# Altium project EE311_Example_Boost.PrjPcb
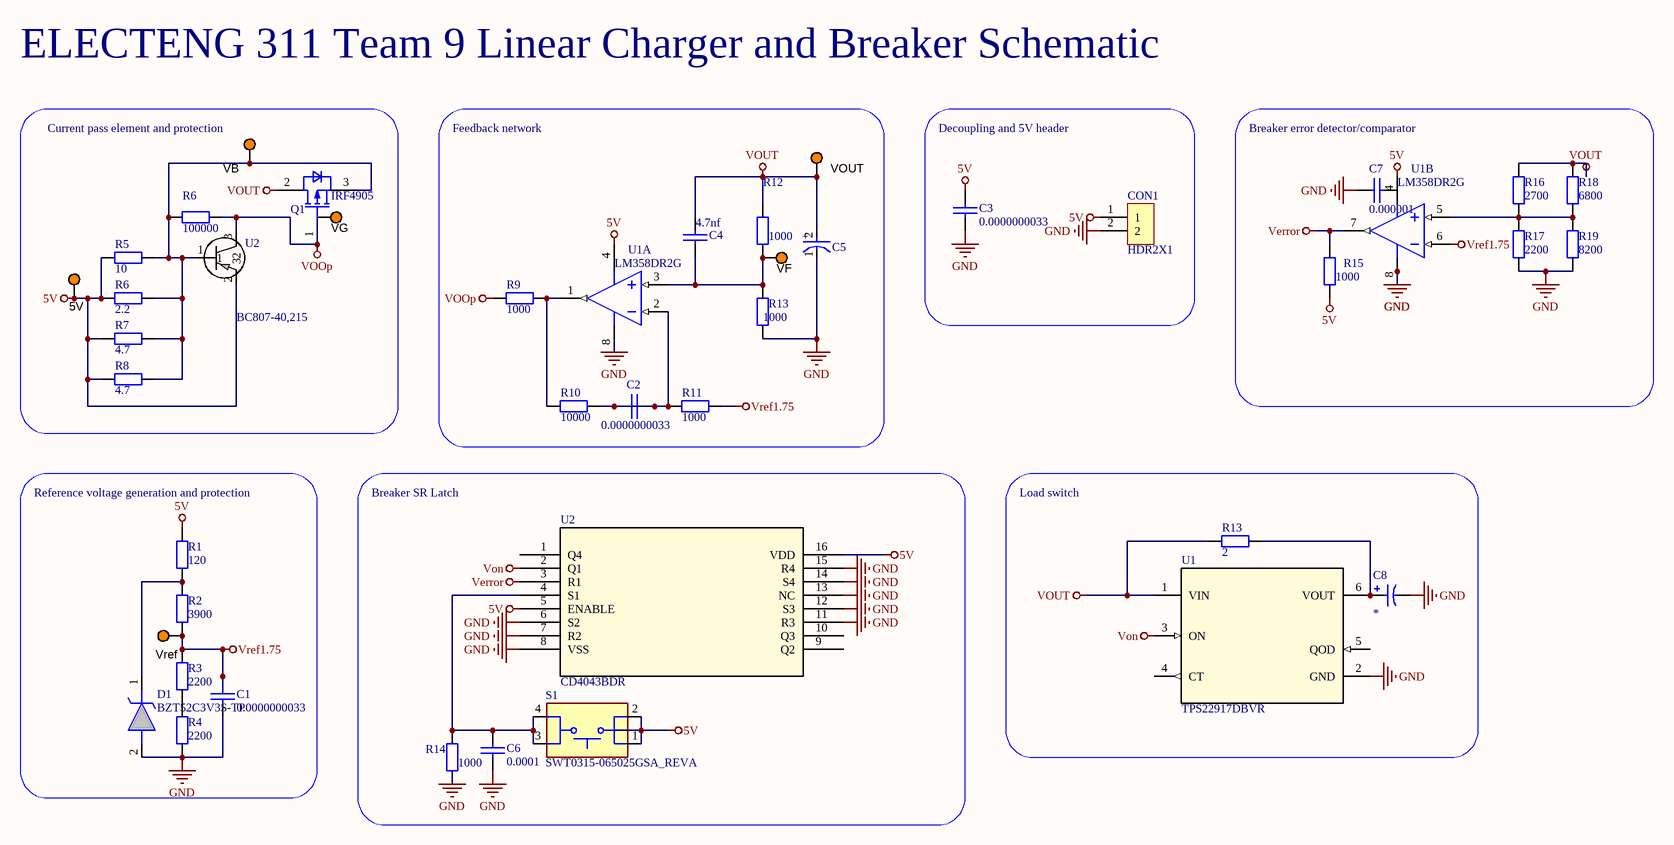
[diagram p0: EE311_Example_Boost_Sch.SchDoc]
1 sheet, 43 parts. Net scope: global (net labels, ports and power ports of the same name join across sheets).
Board file: EE311_Example_Boost_PCB.PcbDoc

## Sheet EE311_Example_Boost_Sch.SchDoc: ELECTENG 311 - Boost Converter
size A3; Author: Duleepa J Thrimawithana; Organization: Power Electronics Group; Address1: The University of Auckland; Address2: 20 Symonds Street; Address3: Auckland 1010; Address4: New Zealand; Revision: 1R1; SheetNumber: 1; SheetTotal: 1

### Parts
(Parts that share a designator on the sheet are numbered #1, #2 ... from top to bottom, then left to right.)
5V  5003  [TP_TH]  (value not drawn)
C1  0.0000000033  [0805 CAP]
C2  0.0000000033  [0805 CAP]
C3  0.0000000033  [0805 CAP]
C4  4.7nf  [0805 CAP]
C5  EEE-FK1K330P  [FP-FKF-MFG]  (value not drawn)
C6  0.0001  [0805 CAP]
C7  0.000001  [0805 CAP]
C8  *  [CAP-RAD-2.5mm Pitch]
CON1  HDR2X1  [HDR2X1_2P54]
D1  BZT52C3V3S-TP  [SOD2512X115N]
Q1  IRF4905  [IFX-PG-TO220-3-904-1]
R1  120  [0805 RES]
R2  3900  [0805 RES]
R3  2200  [0805 RES]
R4  2200  [0805 RES]
R5  10  [0805 RES]
R6#1  100000  [0805 RES]
R6#2  2.2  [0805 RES]
R7  4.7  [0805 RES]
R8  4.7  [0805 RES]
R9  1000  [0805 RES]
R10  10000  [0805 RES]
R11  1000  [0805 RES]
R12  1000  [0805 RES]
R13#1  1000  [0805 RES]
R13#2  2  [0805 RES]
R14  1000  [0805 RES]
R15  1000  [0805 RES]
R16  2700  [0805 RES]
R17  2200  [0805 RES]
R18  6800  [0805 RES]
R19  8200  [0805 RES]
S1  SWT0315-065025GSA_REVA  [SW_SWT0315-065025GSA_REVA]
U1#1  LM358DR2G  [ONSC-SOIC-8-751-07_V]  (parts A,B of 2)
U1#2  TPS22917DBVR  [DBV0006_N]
U2#1  BC807-40,215  [SOT23_NEX]
U2#2  CD4043BDR  [D16]
VB  5003  [TP_TH]  (value not drawn)
VF  5003  [TP_TH]  (value not drawn)
VG  5003  [TP_TH]  (value not drawn)
VOUT  5003  [TP_TH]  (value not drawn)
Vref  5003  [TP_TH]  (value not drawn)

### Blocks framed on the sheet
Current pass element and protection: 5V Q1 R5 R6#1 R6#2 R7 R8 U2#1 VB VG
Feedback network: C2 C4 C5 R9-R12 R13#1 U1#1 VF VOUT
Decoupling and 5V header: C3 CON1
Breaker error detector/comparator: C7 R15-R19 U1#1
Reference voltage generation and protection: C1 D1 R1-R4 Vref
Breaker SR Latch: C6 R14 S1 U2#2
Load switch: C8 R13#2 U1#2

### Nets
5V: 5V.1 C3.2 CON1.1 R1.2 R5.1 R6#2.1 R7.1 R8.1 R15.1 S1.1 S1.2 U1#1.4(VEE/GND) U2#1.2(3) U2#2.5(ENABLE) U2#2.16(VDD)
GND: C1.1 C3.1 C5.1(C) C6.2 C7.1 C8.2 CON1.2 D1.2(A) R4.2 R13#1.1 R14.1 R17.1 R19.2 U1#1.8(VCC) U1#2.2(GND) U2#2.6(S2) U2#2.7(R2) U2#2.8(VSS) U2#2.11(R3) U2#2.12(S3) U2#2.13(NC) U2#2.14(S4) U2#2.15(R4)
Verror: R15.2 U1#1.7(OUTB) U2#2.3(R1)
Von: U1#2.3(ON) U2#2.2(Q1)
VOOp: Q1.1(GATE) R6#1.2 R9.1 U2#1.3(2) VG.1
VOUT: C4.1 C5.2(A) Q1.2(DRAIN) R12.2 R13#2.1 R16.1 R18.1 U1#2.1(VIN) VOUT.1
Vref1.75: C1.2 R2.2 R3.1 R11.2 U1#1.6(INB-) Vref.1
NetC2_1: C2.1 C2.2 R10.1 R11.1 U1#1.2(INA-)
NetC4_2: C4.2 R12.1 R13#1.2 U1#1.3(INA+) VF.1
NetC6_1: C6.1 R14.2 S1.3 S1.4 U2#2.4(S1)
NetC8_1: C8.1 R13#2.2 U1#2.6(VOUT)
NetD1_1: D1.1(K) R1.1 R2.1
NetQ1_3: Q1.3(SOURCE) R5.2 R6#1.1 R6#2.2 R7.2 R8.2 U2#1.1 VB.1
NetR3_2: R3.2 R4.1
NetR9_2: R9.2 R10.2 U1#1.1(OUTA)
NetR16_2: R16.2 R17.2 R18.2 R19.1 U1#1.5(INB+)

Not connected (* = marked no-connect by the designer): C7 2; U1#2 4(CT) 5(QOD); U2#2 1(Q4) 9(Q2) 10(Q3)

### Notes on the sheet
- ELECTENG 311 Team 9 Linear Charger and Breaker Schematic
- Title:
- Author:
- Date:
- Time:
- Revision:
- Sheet
- of
- File:
- (in symbol CMP-001-00000-1) +

### Library data of the parts
5V VB VF VG VOUT Vref = TestPoint: Test Point, Orange, 1-Pin THD, RoHS; Peak Reverse Current: 600 uA; Forward Current: 3 A; Max Surge Current: 80 A; Forward Voltage: 1.08 V; Max Operating Temperature: 150 degC; PackageReference: 5003; Pins: 2; ComponentLink2URL: http://keyelco.com/userAssets/file/M65p56.pdf; PackageDescription: 1-Pin Through Hole Device, Dia 2.54 mm; Weight: 0.01 lb; Diameter: 5.3 mm; Mount: Through Hole; Package Quantity: 500; Packaging: Bulk; Min Operating Temperature: -65 degC; ComponentLink1Description: Manufacturer URL; Height: 0.25 inch; ComponentLink1URL: http://www.keyelco.com/; ComponentLink2Description: Datasheet; Width: 0.25 inch; REACH SVHC: No SVHC; RoHSCompliant: true; Radiation Hardening: No; Length: 9.5 mm; DatasheetVersion: Jun-15
C1-C4 C6 C7 = CerCap_SMT_0805: SMT ceramic capacitor 0805 size; Value: *
C5 = CMP-001-00000-1: Aluminum Electrolytic Capacitor, Polarized, Aluminum (wet), 80V, 20% +Tol, 20% -Tol, 33uF, Surface Mount, 3333; Manufacturer: Panasonic; Capacitor Type: Aluminium; Value: 33µF; Pins: 2; Case/Package: 3333; RoHS Compliant: Yes; Height: 10.2mm; Mounting Technology: Surface Mount; Min Operating Temperature: -55°C; Dielectric Material: Aluminium; Max Operating Temperature: 105°C; Manufacturer Part Number: EEE-FK1K330P; Component Type: Capacitors
C8 = ElecCap_TH_2P0: Electrolytic capacitor with radial package, 2mm pitch and 5.2mm diameter; Published: 8-Jun-2000; LatestRevisionDate: 17-Jul-2002; LatestRevisionNote: Re-released for DXP Platform.; PackageReference: POLAR0.8; Publisher: Altium Limited; PackageDescription: Polarized Capacitor; 2 Leads; Value: *
CON1 = CMP-004-000000-7: Header 2X1; Design Item ID: HDR2X1; Source: CommonSymbols_V1.SchLib; Component Type: Connectors
D1 = BZT52C3V3S-TP: Zener Diodes; Manufacturer_Name: MCC; Geometry.Height: 1.15mm; Mouser Part Number: 833-BZT52C3V3S-TP; Mouser Price/Stock: https://www.mouser.co.uk/ProductDetail/Micro-Commercial-Components-MCC/BZT52C3V3S-TP?qs=ZNK0BnemlqG8WPvv%2FxVbdg%3D%3D; Manufacturer_Part_Number: BZT52C3V3S-TP; Datasheet Link: https://mccsemi.com/pdf/Products/BZT52C2V0S-BZT52C56S(200mW)(SOD-323).pdf
Q1 = IRF4905: OptiMOS - P2 Power-Transistor, P-channel-Enhancement mode, VDS -30V; Manufacturer: Infineon Technologies; Manufacturer Order NumberManufacturer Order Number: IRF4905; PackageReference: PG-TO220-3-904
R1-R5 R6#1 R6#2 R7-R12 R13#1 R13#2 R14-R19 = Res_SMT_0805: 0805 resistor; Published: 8-Jun-2000; LatestRevisionDate: 17-Jul-2002; LatestRevisionNote: Re-released for DXP Platform.; PackageReference: AXIAL-0.4; Publisher: Altium Limited; Value: *; ComponentLink1Description: https://nz.mouser.com/datasheet/2/315/AOA0000C304-1149620.pdf
S1 = SWT0315-065025GSA_REVA: 6mm x 6mm Gull Wing Tactile Switch; MF: Global Connector Technology; SnapEDA_Link: https://www.snapeda.com/parts/SWT0315-065025GSA/Global+Connector+Technology/view-part/?ref=snap; Package: None; Value: *; MP: SWT0315-065025GSA; Check_prices: https://www.snapeda.com/parts/SWT0315-065025GSA/Global+Connector+Technology/view-part/?ref=eda
U1#1 = CMP-014-00017-2: Single Supply Dual Operational Amplifier, 3 to 32 V, 0 to 70 degC, 8-Pin SOIC, Pb-Free, Tape and Reel; Manufacturer: ON Semiconductor; Max Supply Voltage: 44V; Max Input Voltage: 28.3V; Nominal Voltage Gain: 100dB; Slew Rate: 0.07V/us; Common Mode Rejection Ratio: 65dB; Nominal Supply Voltage: 12V; Min Supply Voltage: 2.3V; Channels: 2; Max Dual Supply Voltage: 16V; Nominal Supply Current: 35uA; Output Current: 40mA; Min Dual Supply Voltage: 1.5V; Nominal Gain Bandwith Product: 200KHz; Min Input Voltage: 0uV; Package Reference: SOIC-8-751-07; Package Description: 8-Pin Small Outline Integrated Circuit, Body 4.9 x 3.9 mm, Pitch 1.27 mm; Min Operating Temperature: 0°C; Max Operating Temperature: 70°C; Case/Package: SOIC; Datasheet URL: http://www.onsemi.cn/pub_link/Collateral/LM358-D.PDF; Manufacturer URL: http://www.onsemi.com/; Packaging: TapeandReel; Pins: 8; RoHS Compliant: True; Datasheet Version: Rev. 32, 10/2016; Package Quantity: 2500; Nominal Dual Supply Voltage: 12V; Mounting Technology: SM
U1#2 = TPS22917DBVR: 5.5-V, 2-A, 80-mÎ© , 10-nA leakage load switch adj. rise time and adj output discharge 6-SOT-23 -40 to 125; Manufacturer_Name: Texas Instruments; TYPE: TYPE; RefDes: RefDes; Copyright: Copyright (C) 2026 Ultra Librarian. All rights reserved.; Manufacturer_Part_Number: TPS22917DBVR
U2#1 = BC807-40,215: Description; Manufacturer_Name: Nexperia; Copyright: Copyright (C) 2026 Ultra Librarian. All rights reserved.; Manufacturer_Part_Number: BC807-40,215
U2#2 = CD4043BDR: CMOS Quad NOR R/S Latch with 3-State Outputs 16-SOIC -55 to 125; Manufacturer_Name: Texas Instruments; Copyright: Copyright (C) 2025 Ultra Librarian. All rights reserved.; Manufacturer_Part_Number: CD4043BDR; RefDes: RefDes; Type: Type